# EAGLE schematic DCDCFinalSchematic (EAGLE 9.5.2)
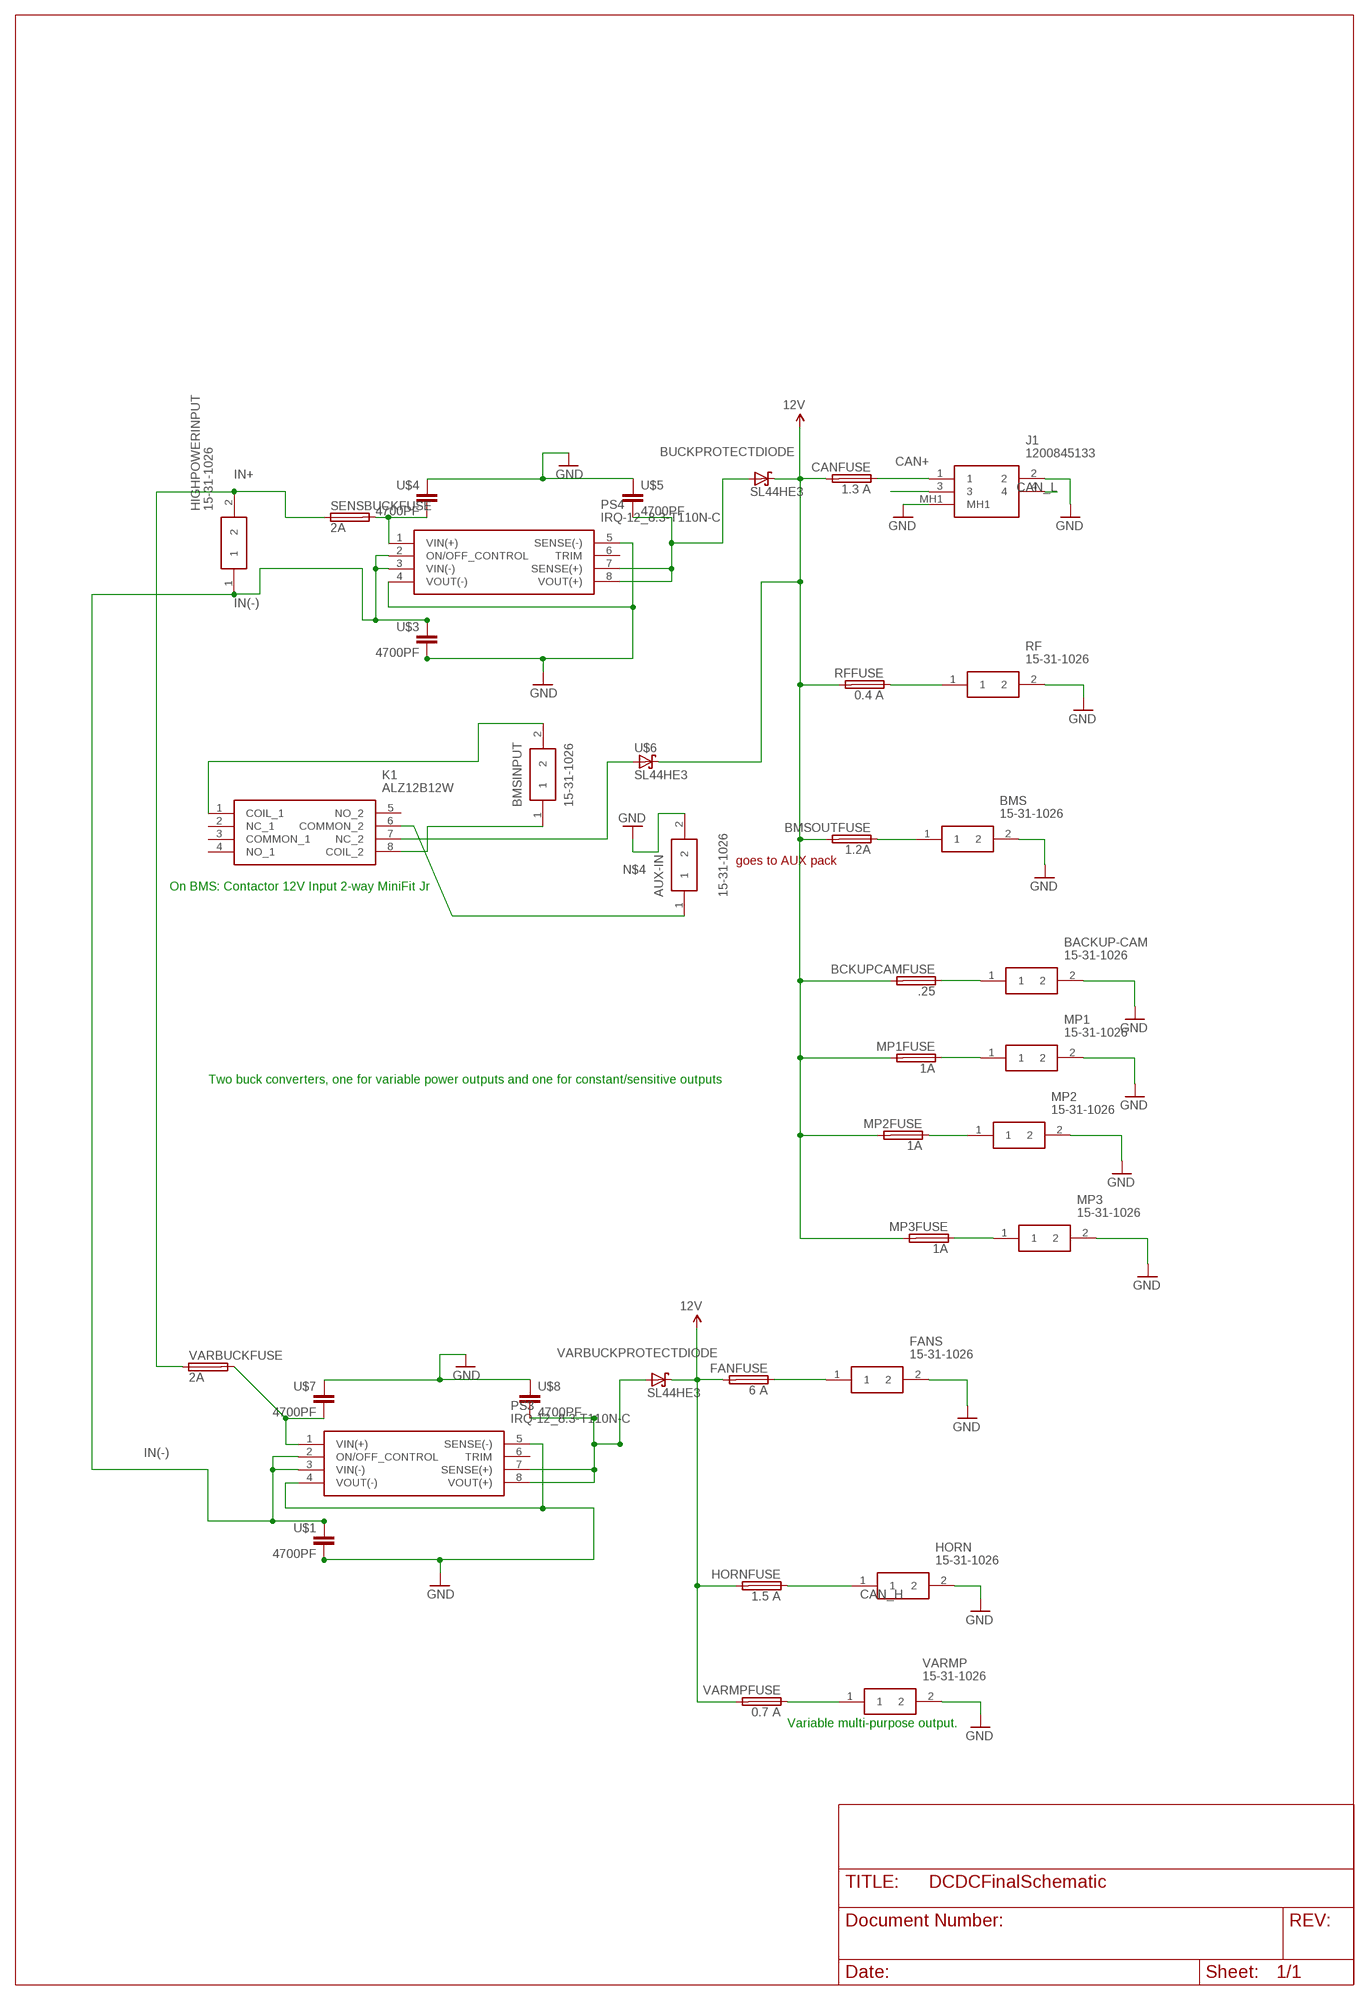
[diagram p0: schematic, sheet 1]

## Parts
AUX-IN  15-31-1026  [15311026]
BACKUP-CAM  15-31-1026  [15311026]
BCKUPCAMFUSE  .25  SMD-MICRO-FUSE-BLOCK  [OMNIBLOK]
BMS  15-31-1026  [15311026]
BMSINPUT  15-31-1026  [15311026]
BMSOUTFUSE  1.2A  SMD-MICRO-FUSE-BLOCK  [OMNIBLOK]
BUCKPROTECTDIODE  SL44HE3  [SMC]
CANFUSE  1.3 A  SMD-MICRO-FUSE-BLOCK  [OMNIBLOK]
FANFUSE  6 A  SMD-MICRO-FUSE-BLOCK  [OMNIBLOK]
FANS  15-31-1026  [15311026]
HIGHPOWERINPUT  15-31-1026  [15311026]
HORN  15-31-1026  [15311026]
HORNFUSE  1.5 A  SMD-MICRO-FUSE-BLOCK  [OMNIBLOK]
J1  1200845133  [1200845133]
K1  ALZ12B12W  [ALZ12B12W]
MP1  15-31-1026  [15311026]
MP1FUSE  1A  SMD-MICRO-FUSE-BLOCK  [OMNIBLOK]
MP2  15-31-1026  [15311026]
MP2FUSE  1A  SMD-MICRO-FUSE-BLOCK  [OMNIBLOK]
MP3  15-31-1026  [15311026]
MP3FUSE  1A  SMD-MICRO-FUSE-BLOCK  [OMNIBLOK]
PS3  IRQ-12_8.3-T110N-C  [IRQ1283T110NC]
PS4  IRQ-12_8.3-T110N-C  [IRQ1283T110NC]
RF  15-31-1026  [15311026]
RFFUSE  0.4 A  SMD-MICRO-FUSE-BLOCK  [OMNIBLOK]
SENSBUCKFUSE  2A  SMD-MICRO-FUSE-BLOCK  [OMNIBLOK]
U$1  4700PF  [Y2_CAP]
U$3  4700PF  [Y2_CAP]
U$4  4700PF  [Y2_CAP]
U$5  4700PF  [Y2_CAP]
U$6  SL44HE3  [SMC]
U$7  4700PF  [Y2_CAP]
U$8  4700PF  [Y2_CAP]
VARBUCKFUSE  2A  SMD-MICRO-FUSE-BLOCK  [OMNIBLOK]
VARBUCKPROTECTDIODE  SL44HE3  [SMC]
VARMP  15-31-1026  [15311026]
VARMPFUSE  0.7 A  SMD-MICRO-FUSE-BLOCK  [OMNIBLOK]

## Nets
12V: BCKUPCAMFUSE.P$2 BMSOUTFUSE.P$2 BUCKPROTECTDIODE.C CANFUSE.P$2 FANFUSE.P$2 HORNFUSE.P$2 MP1FUSE.P$2 MP2FUSE.P$2 MP3FUSE.P$2 RFFUSE.P$2 U$6.C VARBUCKPROTECTDIODE.C VARMPFUSE.P$2
CAN+: BACKUP-CAM.1 BCKUPCAMFUSE.P$1 CANFUSE.P$1 J1.1
CAN_H: J1.3
CAN_L: J1.4
GND: AUX-IN.2 BACKUP-CAM.2 BMS.2 FANS.2 HORN.2 J1.2 J1.MH1 MP1.2 MP2.2 MP3.2 PS3.4(VOUT(-)) PS3.5(SENSE(-)) PS4.4(VOUT(-)) PS4.5(SENSE(-)) RF.2 U$1.P$2 U$3.P$2 U$4.P$1 U$5.P$1 U$7.P$1 U$8.P$1 VARMP.2
IN(-): HIGHPOWERINPUT.1 PS3.2(ON/OFF_CONTROL) PS3.3(VIN(-)) PS4.2(ON/OFF_CONTROL) PS4.3(VIN(-)) U$1.P$1 U$3.P$1
IN+: HIGHPOWERINPUT.2 SENSBUCKFUSE.P$1 VARBUCKFUSE.P$1
N$1: HORN.1 HORNFUSE.P$1
N$2: AUX-IN.1 K1.6(COMMON_2)
N$3: BMSINPUT.1 K1.8(COIL_2)
N$4: BMSINPUT.2 K1.1(COIL_1) K1.7(NC_2) U$6.A
N$5: PS3.1(VIN(+)) U$7.P$2 VARBUCKFUSE.P$2
N$6: VARMP.1 VARMPFUSE.P$1
N$7: RF.1 RFFUSE.P$1
N$8: FANFUSE.P$1 FANS.1
N$9: PS4.1(VIN(+)) SENSBUCKFUSE.P$2 U$4.P$2
N$10: BMS.1 BMSOUTFUSE.P$1
N$11: MP2.1 MP2FUSE.P$1
N$12: MP3.1 MP3FUSE.P$1
N$13: PS3.7(SENSE(+)) PS3.8(VOUT(+)) U$8.P$2 VARBUCKPROTECTDIODE.A
N$14: MP1.1 MP1FUSE.P$1
N$15: BUCKPROTECTDIODE.A PS4.7(SENSE(+)) PS4.8(VOUT(+)) U$5.P$2
Unconnected: K1.2(NC_1) K1.3(COMMON_1) K1.4(NO_1) K1.5(NO_2) PS3.6(TRIM) PS4.6(TRIM)

## Notes on the sheet
- goes to AUX pack
- On BMS: Contactor 12V Input 2-way MiniFit Jr
- Two buck converters, one for variable power outputs and one for constant/sensitive outputs
- Variable multi-purpose output.

## Library data of the parts
AUX-IN BACKUP-CAM BMS BMSINPUT FANS HIGHPOWERINPUT HORN MP1-MP3 RF VARMP = SamacSys_Parts:15-31-1026: Molex STANDARD .093 Series, Series Number 5025, 6.7mm Pitch 2 Way 1 Row Straight PCB Header, Solder Termination, 12A Source: Datasheet <https://componentsearchengine.com/Datasheets/1/15-31-1026.pdf>; DESCRIPTION: Molex STANDARD .093 Series, Series Number 5025, 6.7mm Pitch 2 Way 1 Row Straight PCB Header, Solder Termination, 12A; HEIGHT: 15mm; MANUFACTURER_NAME: Molex; MANUFACTURER_PART_NUMBER: 15-31-1026; MOUSER_PART_NUMBER: 538-15-31-1026; MOUSER_PRICE-STOCK: https://www.mouser.com/Search/Refine.aspx?Keyword=538-15-31-1026
BCKUPCAMFUSE BMSOUTFUSE CANFUSE FANFUSE HORNFUSE MP1FUSE MP2FUSE MP3FUSE RFFUSE SENSBUCKFUSE VARBUCKFUSE VARMPFUSE = f-lf-omniblok-s:SMD-MICRO-FUSE
BUCKPROTECTDIODE U$6 VARBUCKPROTECTDIODE = diode:SL44HE3
J1 = SamacSys_Parts:1200845133: Circular Metric Connectors M12-RECEPT-5P-FEM- BACK M16x1.5 Source: Datasheet <https://componentsearchengine.com/Datasheets/1/1200845133.pdf>; DESCRIPTION: Circular Metric Connectors M12-RECEPT-5P-FEM- BACK M16x1.5; HEIGHT: 24.2mm; MANUFACTURER_NAME: Molex; MANUFACTURER_PART_NUMBER: 1200845133; MOUSER_PART_NUMBER: 538-1200845133; MOUSER_PRICE-STOCK: https://www.mouser.com/Search/Refine.aspx?Keyword=538-1200845133
K1 = SamacSys_Parts:ALZ12B12W: Low profile: 15.7mm height 1a/1c 16A power relay Source: Datasheet <https://www3.panasonic.biz/ac/e_download/control/relay/power/catalog/mech_eng_lz.pdf?via=ok>; DESCRIPTION: Low profile: 15.7mm height 1a/1c 16A power relay; HEIGHT: 15.7mm; MANUFACTURER_NAME: Panasonic; MANUFACTURER_PART_NUMBER: ALZ12B12W
PS3 PS4 = SamacSys_Parts:IRQ-12_8.3-T110N-C: Isolated DC/DC Converters 12V/8.3A 57.6-160Vin Isolated 1/4Brick Source: Datasheet <https://componentsearchengine.com/Datasheets/1/IRQ-12_8.3-T110N-C.pdf>; DESCRIPTION: Isolated DC/DC Converters 12V/8.3A 57.6-160Vin Isolated 1/4Brick; HEIGHT: 13.2mm; MANUFACTURER_NAME: Murata Electronics; MANUFACTURER_PART_NUMBER: IRQ-12/8.3-T110N-C; MOUSER_PART_NUMBER: 580-IRQ-12/8.3T110NC; MOUSER_PRICE-STOCK: https://www.mouser.com/Search/Refine.aspx?Keyword=580-IRQ-12%2F8.3T110NC
U$1 U$3-U$5 U$7 U$8 = NUSOLAR_Custom:4700PF